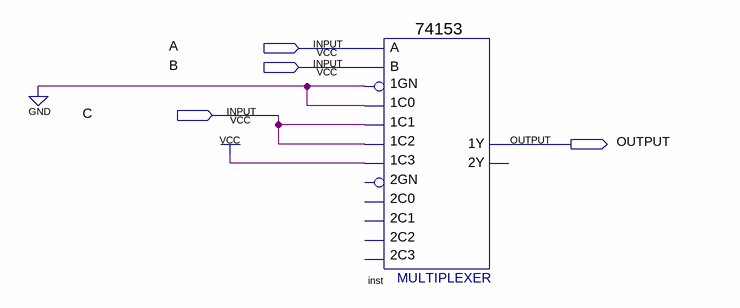
[diagram p0: schematic sheet]
// Quartus schematic E3_74153.bdf as structural Verilog: 1 symbols, 4 pins
module E3_74153 (
  input  A,
  input  B,
  input  C,
  output OUTPUT
);

  \74153  inst (
    .\1C1 (C), .\1GN (1'b0), .\1C0 (1'b0), .\1C2 (C), .\1C3 (1'b1), .B(B), .A(A), .\1Y (OUTPUT));  // open: 2C0, 2GN, 2C2, 2C1, 2C3, 2Y
endmodule
